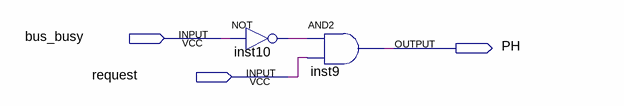
[diagram p0: schematic sheet]
// Quartus schematic arbitrator.bdf as structural Verilog: 2 symbols, 3 pins
module arbitrator (
  input  bus_busy,
  input  request,
  output PH
);

  wire inst10_out;

  not inst10 (inst10_out, bus_busy);
  and inst9 (PH, inst10_out, request);
endmodule
